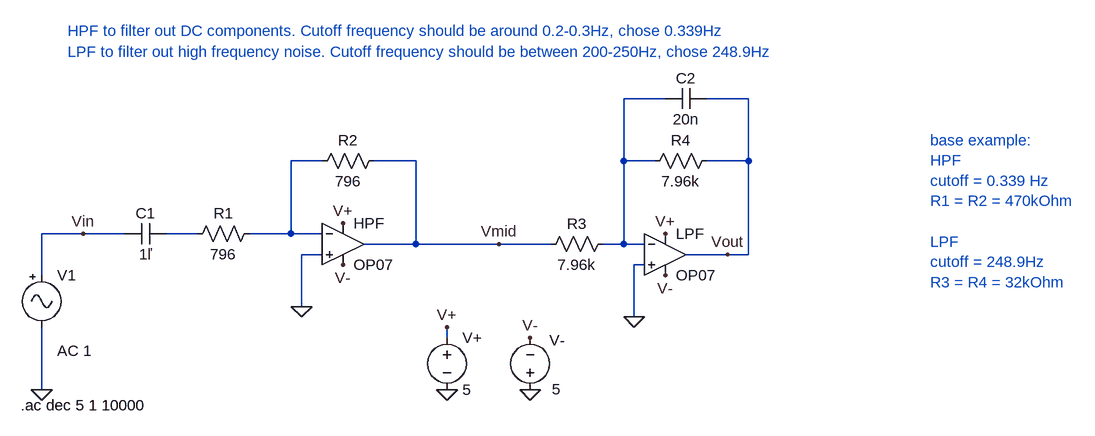
[diagram p0: schematic Monolithic.asc]
Monolithic.asc, the LTspice schematic file:
Version 4
SHEET 1 1424 680
WIRE 560 -80 496 -80
WIRE 688 -80 624 -80
WIRE 32 16 -16 16
WIRE 176 16 112 16
WIRE 496 16 496 -80
WIRE 544 16 496 16
WIRE 688 16 688 -80
WIRE 688 16 624 16
WIRE -336 128 -400 128
WIRE -272 128 -336 128
WIRE -160 128 -208 128
WIRE -16 128 -16 16
WIRE -16 128 -80 128
WIRE 32 128 -16 128
WIRE 176 144 176 16
WIRE 176 144 96 144
WIRE 304 144 176 144
WIRE 384 144 304 144
WIRE 496 144 496 16
WIRE 496 144 464 144
WIRE 528 144 496 144
WIRE 32 160 0 160
WIRE 656 160 592 160
WIRE 688 160 688 16
WIRE 688 160 656 160
WIRE 528 176 512 176
WIRE -400 192 -400 128
WIRE 0 240 0 160
WIRE 512 256 512 176
WIRE 224 288 224 272
WIRE -400 368 -400 272
FLAG 0 240 0
FLAG 512 256 0
FLAG -400 368 0
FLAG 224 368 0
FLAG 352 368 0
FLAG 656 160 Vout
FLAG -336 128 Vin
FLAG 304 144 Vmid
FLAG 224 272 V+
FLAG 560 128 V+
FLAG 64 112 V+
FLAG 352 288 V-
FLAG 560 192 V-
FLAG 64 176 V-
SYMBOL res -64 112 R90
WINDOW 0 0 56 VBottom 2
WINDOW 3 32 56 VTop 2
SYMATTR InstName R1
SYMATTR Value 796
SYMBOL res 128 0 R90
WINDOW 0 0 56 VBottom 2
WINDOW 3 32 56 VTop 2
SYMATTR InstName R2
SYMATTR Value 796
SYMBOL res 480 128 R90
WINDOW 0 0 56 VBottom 2
WINDOW 3 32 56 VTop 2
SYMATTR InstName R3
SYMATTR Value 7.96k
SYMBOL res 640 0 R90
WINDOW 0 0 56 VBottom 2
WINDOW 3 32 56 VTop 2
SYMATTR InstName R4
SYMATTR Value 7.96k
SYMBOL cap -208 112 R90
WINDOW 0 0 32 VBottom 2
WINDOW 3 32 32 VTop 2
SYMATTR InstName C1
SYMATTR Value 1ľ
SYMBOL cap 624 -96 R90
WINDOW 0 0 32 VBottom 2
WINDOW 3 32 32 VTop 2
SYMATTR InstName C2
SYMATTR Value 20n
SYMBOL Misc\\signal -400 176 R0
WINDOW 123 24 132 Left 2
WINDOW 39 0 0 Left 0
SYMATTR Value2 AC 1
SYMATTR InstName V1
SYMATTR Value ""
SYMBOL voltage 224 272 R0
WINDOW 123 0 0 Left 0
WINDOW 39 0 0 Left 0
SYMATTR InstName V+
SYMATTR Value 5
SYMBOL voltage 352 384 R180
WINDOW 0 -54 92 Left 2
WINDOW 3 -47 17 Left 2
WINDOW 123 0 0 Left 0
WINDOW 39 0 0 Left 0
SYMATTR InstName V-
SYMATTR Value 5
SYMBOL OpAmps\\OP07 64 80 R0
SYMATTR InstName HPF
SYMBOL OpAmps\\OP07 560 96 R0
SYMATTR InstName LPF
TEXT -360 -184 Left 2 ;HPF to filter out DC components. Cutoff frequency should be around 0.2-0.3Hz, chose 0.339Hz
TEXT -360 -152 Left 2 ;LPF to filter out high frequency noise. Cutoff frequency should be between 200-250Hz, chose 248.9Hz
TEXT -432 392 Left 2 !.ac dec 5 1 10000
TEXT 968 -16 Left 2 ;base example: \nHPF\ncutoff = 0.339 Hz\nR1 = R2 = 470kOhm\n \nLPF\ncutoff = 248.9Hz\nR3 = R4 = 32kOhm

The netlist it stands for:
* Monolithic.asc
R1 N002 N003 796
R2 Vmid N002 796
R3 N001 Vmid 7.96k
R4 Vout N001 7.96k
C1 N003 Vin 1ľ
C2 Vout N001 20n
V1 Vin 0 AC 1
V+ V+ 0 5
V- 0 V- 5
XHPF 0 N002 V+ V- Vmid LT1001  ; OP07, pins In+ In- V+ V- OUT
XLPF 0 N001 V+ V- Vout LT1001  ; OP07, pins In+ In- V+ V- OUT
* HPF to filter out DC components. Cutoff frequency should be around 0.2-0.3Hz, chose 0.339Hz
* LPF to filter out high frequency noise. Cutoff frequency should be between 200-250Hz, chose 248.9Hz
.ac dec 5 1 10000
* base example:
* HPF
* cutoff = 0.339 Hz
* R1 = R2 = 470kOhm
* LPF
* cutoff = 248.9Hz
* R3 = R4 = 32kOhm
.lib LTC.lib
.backanno
.end